# EAGLE design relayboard_1 (EAGLE 9.6.2)
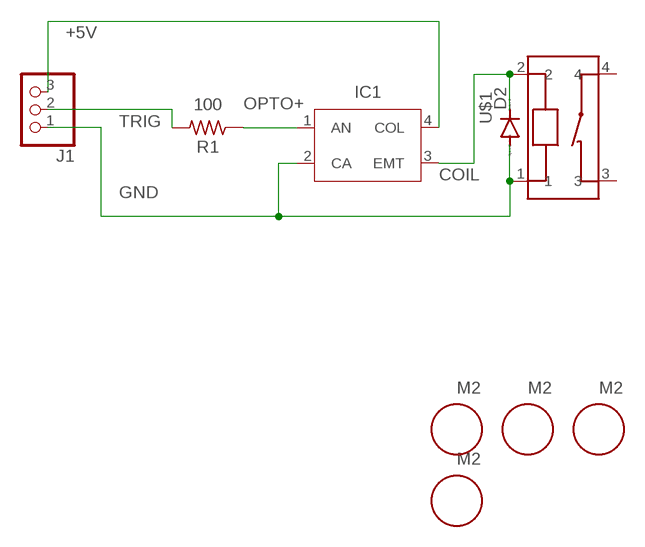
[diagram p0: schematic, sheet 1]

## Parts
D2  1N4004  [DO41-10]
IC1  FOD817BSDSMT  [DIP1016W60P279L460H460Q4B]
J1  PINHD-1X3  [1X03]
R1  100  R-US_AXIAL-7.2MM-PITCH  [RESAD724W46L381D178B]
S1  M2-POST  [M2-POST]
U$1  ALF1P05  [LF_1_FORM_A_PCB]
U$3  M2-POST  [M2-POST]
U$4  M2-POST  [M2-POST]
U$6  M2-POST  [M2-POST]

## Nets
+5V: IC1.4(COL) J1.3
COIL: D2.C IC1.3(EMT) U$1.2
GND: D2.A IC1.2(CA) J1.1 U$1.1
OPTO+: IC1.1(AN) R1.1
TRIG: J1.2 R1.2
Unconnected: U$1.3 U$1.4

## Library data of the parts
D2 = diode:1N4004: DIODE general purpose rectifier, 1 A
IC1 = Opto-Electronic:FOD817BSD: 4-Pin DIP Phototransistor Optocouplers; CATEGORY: Opto-Electronic; MANUFACTURER: ON Semiconductor; MPN: FOD817BSD; OPERATING_TEMP: -55 to +110 °C; PART_STATUS: Active; ROHS_COMPLIANT: RoHS3 Compliant; SUB-CATEGORY: OptoCoupler; THERMALLOSS: 0.2W; VALUE: FOD817BSD
J1 = Connector:PINHD-1X3: PIN HEADER; CATEGORY: CONNECTOR; SUB-CATEGORY: PIN-HEADER
R1 = Resistor:R-US: Resistor Fixed - ANSI; CATEGORY: Resistor; SUB-CATEGORY: Fixed
S1 U$3 U$4 U$6 = custom1:M2-POST: Hole with keepout clearance for 3.5mm M2 screw brass insert
U$1 = Panasonic Relay:ALF: LF - 1 Form A - Single side stable Data sheet <https://www.panasonic-electric-works.com/eu/download.htm?id=55611> Parameters Max. switching voltage: 250 V AC Max. switching current: 25 A Operational function: Single side stable Contact arrangement: 1 NO Applications Air conditioner Refrigerators OA equipment; U_COIL: 5V DC

## Board
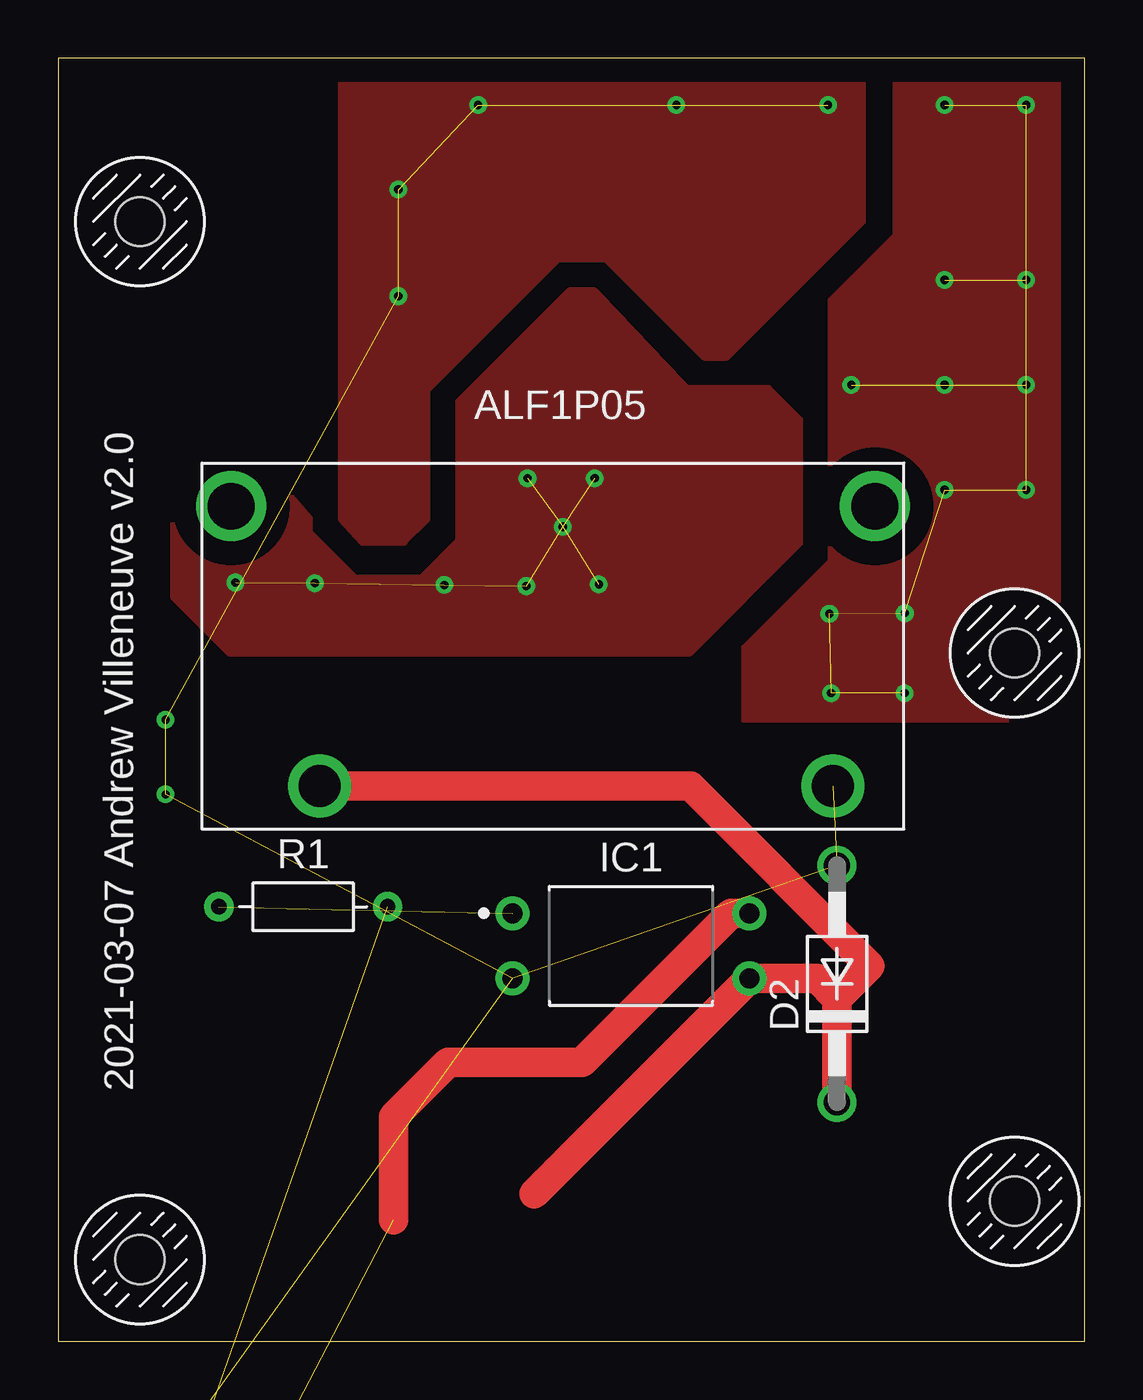
[diagram p1: board, top side]
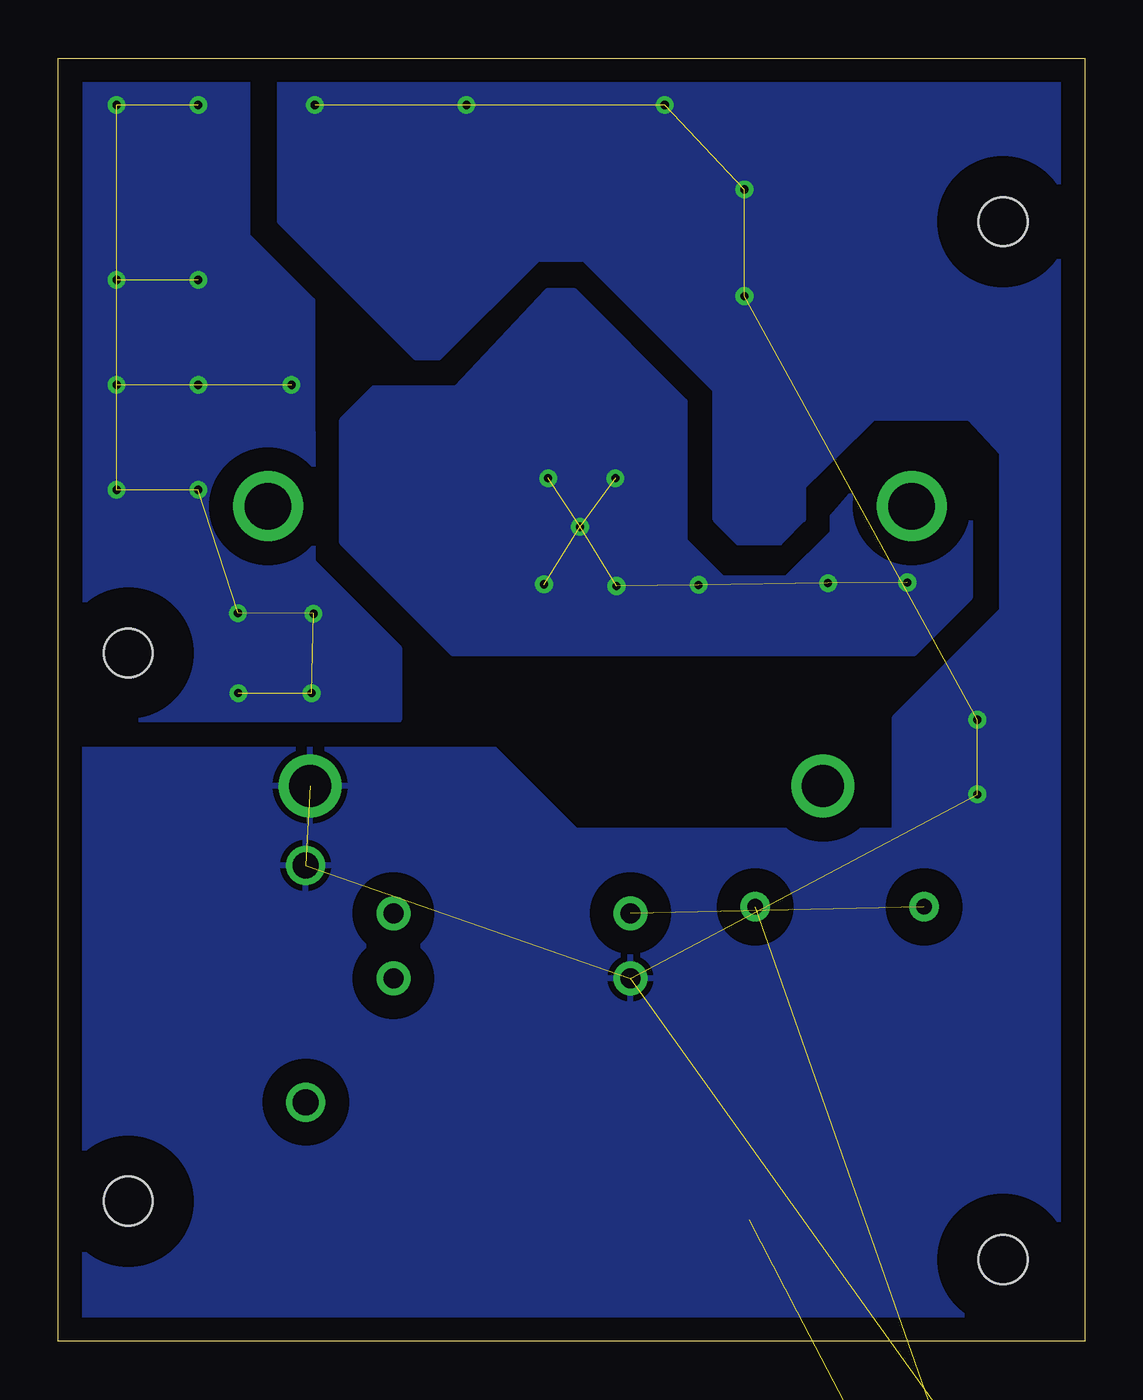
[diagram p2: board, bottom side, seen from below]

Size 44 x 55 mm. Coordinates in mm from the lower left corner, seen from the top.
Outline: 0,0 44,0 44,55 0,55 0,0
Copper layers (1*16): Top 0.035mm / dielectric 1.5mm / Bottom 0.035mm
Design rules "default *": minimum track width 10mil, minimum drill 0.35mm, track to track 40mil, track to pad 20mil, pad to pad 6mil, via to via 6mil, smd to smd 6mil, copper to edge 40mil, drill to drill 6mil, minimum pad ring 10mil, minimum via ring 8mil, stop-mask expansion 4mil, vias tented up to drill 0mil, thermal gap 10mil

### Footprints (pad centres in the part's own frame; a part is rotated, then mirrored left to right if it is on the bottom)
DO41-10 = drill 1.118: A 5.08,0; C -5.08,0
DIP1016W60P279L460H460Q4B = drill 0.854 pad 1.454: 1 -5.08,1.395; 2 -5.08,-1.395; 3 5.08,-1.395; 4 5.08,1.395
1X03 = drill 1.016 long: 1 -2.54,0; 2 0,0; 3 2.54,0
RESAD724W46L381D178B = drill 0.66 pad 1.26: 1 -3.62,0; 2 3.62,0
M2-POST = hole 2.1: 0,0
LF_1_FORM_A_PCB = drill 1.8: 1 -12,6; 2 10,6 | drill 2: 3 -13.8,-6; 4 13.8,-6

### Placement (x,y rotation side)
D2  33.39,15.32 90 top
IC1  24.55,16.95 0 top
J1  4.39,-9.04 0 top  (outside the outline)
R1  10.5,18.62 0 top
S1  3.5,48 0 top
U$1  21.21,29.8 180 top
U$3  3.5,3.5 0 top
U$4  41,6 0 top
U$6  41,29.5 0 top

### Tracks (layer width: path | path; a pad name or v marks a point on that pad's centre or on a via)
12V_IN  (via drill 0.35)  (7 unrouted)
  other vias: 23,37 20.12,37 23.18,32.45 20.07,32.37 21.63,34.92 16.55,32.42 7.6,32.53 11,32.5
  pour Top (no thermals): 10.79,35.27 8.43,38 5.69,38 4.93,37.24 4.93,31.88 7.32,29.49 27.08,29.49 31.83,34.24 31.83,39.5 30.45,40.87 26.96,40.87 23.02,45.03 21.89,45.03 17.14,40.28 17.14,34.32 15.54,32.72 12.75,32.72 10.79,34.67
  pour Bottom (no thermals): 10.79,35.36 8.51,38 5.69,38 4.93,37.24 4.93,31.88 7.32,29.49 27.08,29.49 31.83,34.24 31.83,39.5 30.45,40.87 26.96,40.87 23.02,45.03 21.89,45.03 17.14,40.28 17.14,34.32 15.54,32.72 12.75,32.72 10.79,34.67
+5V  (1 unrouted)
  Top 1.27: 14.38,5.21 14.38,9.63 16.71,11.96 22.45,11.96 28.84,18.34 IC1.4
COIL
  Top 1.27: 33.39,14.68 34.8,16.1 27.1,23.8 13.84,23.8 U$1.2 | 33.39,14.68 D2.C | 33.39,14.68 32.52,15.55 IC1.3 20.4,6.33
DCOUT  (via drill 0.35)  (12 unrouted)
  other vias: 38,45.5 38,41 38,36.5 33.06,31.19 34,41 38,53 41.5,53 41.5,45.5 41.5,41 41.5,36.5 36.29,27.78 36.3,31.21 33.14,27.78
  pour Top (no thermals): 35.9,54.5 35.9,47.4 33.11,44.61 33.1,33.43 29.39,29.72 29.39,26.65 43,26.65 43,54.5
  pour Bottom (no thermals): 35.9,54.5 35.9,47.4 33.11,44.61 33.1,33.43 29.39,29.72 29.39,26.65 43,26.65 43,54.5
GND  (via drill 0.35)  (10 unrouted)
  other vias: 18,53 26.5,53 33,53 4.6,23.44 4.6,26.64 14.58,44.81 14.58,49.38
  pour Top (no thermals): 12.11,54.5 12.11,35.24 13.03,34.24 14.83,34.24 15.82,35.23 15.82,40.77 21.44,46.39 23.46,46.39 27.69,42.17 28.67,42.17 34.5,48 34.5,54.5
  pour Bottom (no thermals): 0.84,54.5 0.84,47.6 12.06,36.63 12.06,35.24 13.07,34.24 14.83,34.24 15.82,35.23 15.82,40.77 21.44,46.39 23.46,46.39 27.69,42.17 28.67,42.17 34.5,48 34.5,54.5
  pour Bottom: 0.69,51.82 0.69,10.62 0.84,10.46 3.53,10.46 6.93,10.54 8.13,11.73 8.13,26.75 3.53,31.34 3.53,38.05 4.95,39.57 9.38,39.57 9.38,43.9
  pour Bottom: 25.3,25.37 21.82,21.89 0.64,21.89 0.64,0.64 43.43,0.64 43.51,0.56 43.51,25.32 43.56,25.37
OPTO+  (1 unrouted)
TRIG  (1 unrouted)

### Text on the board
tPlace: 2021-03-07 Andrew Villeneuve v2.0